# EAGLE schematic CONTROLLER (EAGLE 9.3.2)
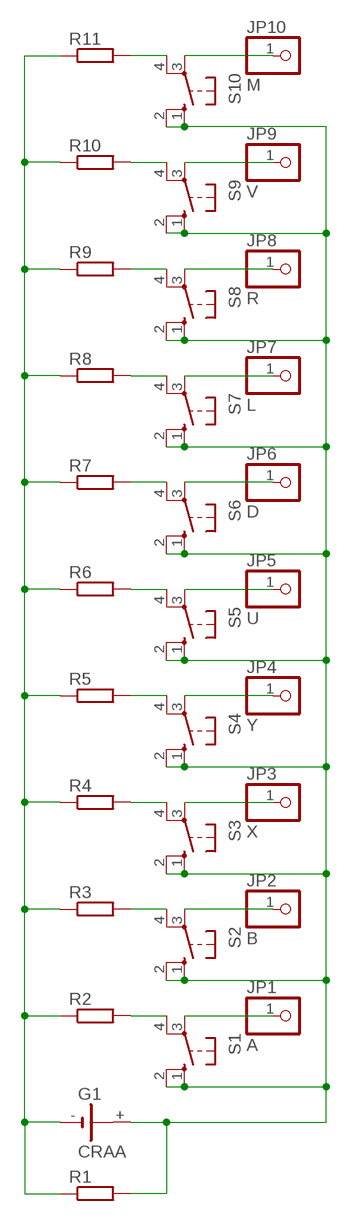
[diagram p0: schematic, sheet 1]

## Parts
G1  CRAA  [CRAA]
JP1  A  PINHD-1X1  [1X01]
JP2  B  PINHD-1X1  [1X01]
JP3  X  PINHD-1X1  [1X01]
JP4  Y  PINHD-1X1  [1X01]
JP5  U  PINHD-1X1  [1X01]
JP6  D  PINHD-1X1  [1X01]
JP7  L  PINHD-1X1  [1X01]
JP8  R  PINHD-1X1  [1X01]
JP9  V  PINHD-1X1  [1X01]
JP10  M  PINHD-1X1  [1X01]
R1  R-EU_0204/7  [0204/7]
R2  R-EU_0204/7  [0204/7]
R3  R-EU_0204/7  [0204/7]
R4  R-EU_0204/7  [0204/7]
R5  R-EU_0204/7  [0204/7]
R6  R-EU_0204/7  [0204/7]
R7  R-EU_0204/7  [0204/7]
R8  R-EU_0204/7  [0204/7]
R9  R-EU_0204/7  [0204/7]
R10  R-EU_0204/7  [0204/7]
R11  R-EU_0204/7  [0204/7]
S1  10-XX  [B3F-10XX]
S2  10-XX  [B3F-10XX]
S3  10-XX  [B3F-10XX]
S4  10-XX  [B3F-10XX]
S5  10-XX  [B3F-10XX]
S6  10-XX  [B3F-10XX]
S7  10-XX  [B3F-10XX]
S8  10-XX  [B3F-10XX]
S9  10-XX  [B3F-10XX]
S10  10-XX  [B3F-10XX]

## Nets
N$1: G1.- R1.1 R2.1 R3.1 R4.1 R5.1 R6.1 R7.1 R8.1 R9.1 R10.1 R11.1
N$2: G1.+ R1.2 S1.1(S) S1.2(S1) S2.1(S) S2.2(S1) S3.1(S) S3.2(S1) S4.1(S) S4.2(S1) S5.1(S) S5.2(S1) S6.1(S) S6.2(S1) S7.1(S) S7.2(S1) S8.1(S) S8.2(S1) S9.1(S) S9.2(S1) S10.1(S) S10.2(S1)
N$3: R2.2 S1.4(P1)
N$4: R8.2 S7.4(P1)
N$5: R7.2 S6.4(P1)
N$6: R6.2 S5.4(P1)
N$7: R5.2 S4.4(P1)
N$8: R4.2 S3.4(P1)
N$9: R3.2 S2.4(P1)
N$10: JP10.1 S10.3(P)
N$11: R11.2 S10.4(P1)
N$12: R10.2 S9.4(P1)
N$13: JP9.1 S9.3(P)
N$14: JP8.1 S8.3(P)
N$15: R9.2 S8.4(P1)
N$16: JP7.1 S7.3(P)
N$17: JP6.1 S6.3(P)
N$18: JP5.1 S5.3(P)
N$19: JP4.1 S4.3(P)
N$20: JP3.1 S3.3(P)
N$21: JP2.1 S2.3(P)
N$22: JP1.1 S1.3(P)
Unconnected: G1.+@1(+)

## Library data of the parts
G1 = battery:CRAA: LI BATTERY Varta
JP1-JP10 = pinhead:PINHD-1X1: PIN HEADER
R1-R11 = rcl:R-EU_: RESISTOR, European symbol; SPICEPREFIX: R
S1-S10 = switch-omron:10-XX: OMRON SWITCH; MPN: B3F-1000; OC_FARNELL: 176432; OC_NEWARK: 36M3542